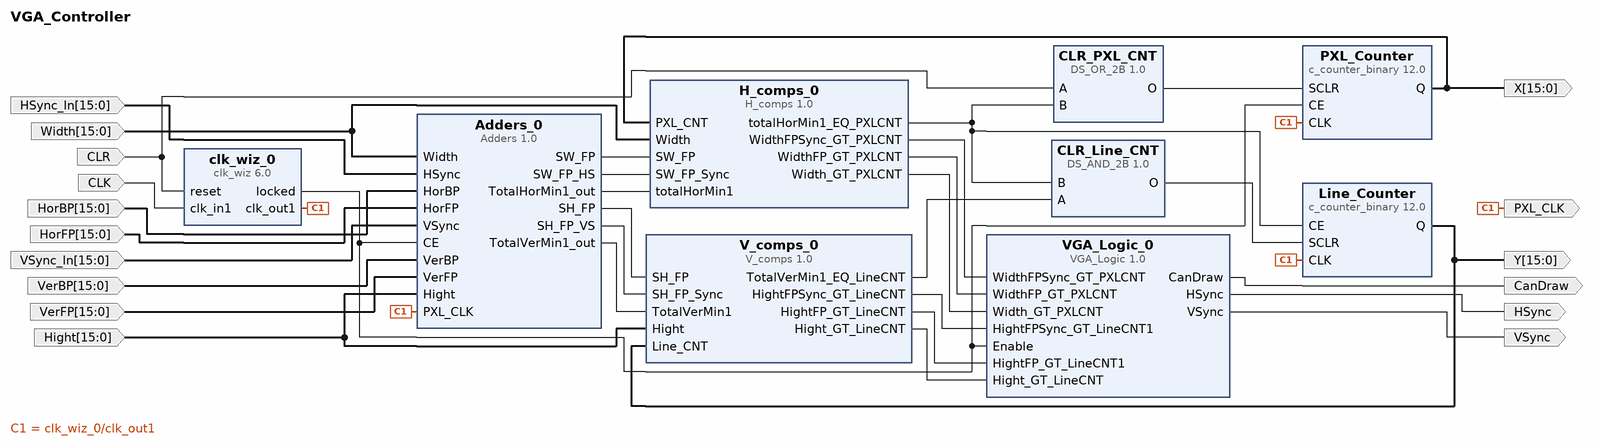
[diagram p0: block diagram of the top level]
# Vivado block design VGA_Controller, xc7z020clg400-1, Vivado 2019.2
create_bd_design VGA_Controller

create_bd_port -dir I -type rst CLR
set_property -dict {CONFIG.POLARITY ACTIVE_HIGH} [get_bd_ports CLR]
create_bd_port -dir I -type clk CLK
set_property -dict {CONFIG.FREQ_HZ 125000000} [get_bd_ports CLK]
create_bd_port -dir O PXL_CLK
create_bd_port -dir O -from 15 -to 0 X
create_bd_port -dir O -from 15 -to 0 -type data Y
create_bd_port -dir O CanDraw
create_bd_port -dir O HSync
create_bd_port -dir O VSync
create_bd_port -dir I -from 15 -to 0 -type data HSync_In
create_bd_port -dir I -from 15 -to 0 -type data Hight
create_bd_port -dir I -from 15 -to 0 -type data HorBP
create_bd_port -dir I -from 15 -to 0 -type data HorFP
create_bd_port -dir I -from 15 -to 0 -type data VSync_In
create_bd_port -dir I -from 15 -to 0 -type data VerBP
create_bd_port -dir I -from 15 -to 0 -type data VerFP
create_bd_port -dir I -from 15 -to 0 -type data Width

create_bd_cell -type ip -vlnv xilinx.com:user:Adders:1.0 Adders_0
create_bd_cell -type ip -vlnv xilinx.com:ip:clk_wiz:6.0 clk_wiz_0
set_property -dict [list \
  CONFIG.CLKIN1_JITTER_PS 80.0 \
  CONFIG.CLKOUT1_JITTER 192.068 \
  CONFIG.CLKOUT1_PHASE_ERROR 222.385 \
  CONFIG.CLKOUT1_REQUESTED_OUT_FREQ 74.2 \
  CONFIG.MMCM_CLKFBOUT_MULT_F 46.375 \
  CONFIG.MMCM_CLKIN1_PERIOD 8.000 \
  CONFIG.MMCM_CLKOUT0_DIVIDE_F 15.625 \
  CONFIG.MMCM_DIVCLK_DIVIDE 5 \
  CONFIG.PRIM_IN_FREQ 125.000 \
] [get_bd_cells clk_wiz_0]
create_bd_cell -type ip -vlnv xilinx.com:ip:c_counter_binary:12.0 PXL_Counter
set_property -dict {CONFIG.CE true CONFIG.SCLR true} [get_bd_cells PXL_Counter]
create_bd_cell -type ip -vlnv xilinx.com:user:H_comps:1.0 H_comps_0
create_bd_cell -type ip -vlnv KULeuven:Digital_systems:DS_OR_2B:1.0 CLR_PXL_CNT
create_bd_cell -type ip -vlnv xilinx.com:ip:c_counter_binary:12.0 Line_Counter
set_property -dict {CONFIG.CE true CONFIG.SCLR true} [get_bd_cells Line_Counter]
create_bd_cell -type ip -vlnv xilinx.com:user:V_comps:1.0 V_comps_0
create_bd_cell -type ip -vlnv xilinx.com:user:VGA_Logic:1.0 VGA_Logic_0
create_bd_cell -type ip -vlnv KULeuven:Digital_systems:DS_AND_2B:1.0 CLR_Line_CNT

# ---- connections ----

connect_bd_net [get_bd_pins clk_wiz_0/clk_out1] \
  [get_bd_pins Adders_0/PXL_CLK] [get_bd_ports PXL_CLK] [get_bd_pins PXL_Counter/CLK] [get_bd_pins Line_Counter/CLK]
connect_bd_net [get_bd_ports CLK] [get_bd_pins clk_wiz_0/clk_in1]
connect_bd_net [get_bd_pins Adders_0/SH_FP] [get_bd_pins V_comps_0/SH_FP]
connect_bd_net [get_bd_pins Adders_0/SH_FP_VS] [get_bd_pins V_comps_0/SH_FP_Sync]
connect_bd_net [get_bd_pins Adders_0/SW_FP] [get_bd_pins H_comps_0/SW_FP]
connect_bd_net [get_bd_pins Adders_0/SW_FP_HS] [get_bd_pins H_comps_0/SW_FP_Sync]
connect_bd_net [get_bd_pins Adders_0/TotalHorMin1_out] [get_bd_pins H_comps_0/totalHorMin1]
connect_bd_net [get_bd_pins Adders_0/TotalVerMin1_out] [get_bd_pins V_comps_0/TotalVerMin1]
connect_bd_net -net c_counter_binary_0_Q [get_bd_pins PXL_Counter/Q] [get_bd_ports X] [get_bd_pins H_comps_0/PXL_CNT]
connect_bd_net [get_bd_pins H_comps_0/WidthFPSync_GT_PXLCNT] [get_bd_pins VGA_Logic_0/WidthFPSync_GT_PXLCNT]
connect_bd_net [get_bd_pins H_comps_0/WidthFP_GT_PXLCNT] [get_bd_pins VGA_Logic_0/WidthFP_GT_PXLCNT]
connect_bd_net [get_bd_pins H_comps_0/Width_GT_PXLCNT] [get_bd_pins VGA_Logic_0/Width_GT_PXLCNT]
connect_bd_net [get_bd_pins clk_wiz_0/locked] [get_bd_pins PXL_Counter/CE] [get_bd_pins Adders_0/CE] [get_bd_pins VGA_Logic_0/Enable]
connect_bd_net [get_bd_ports CLR] [get_bd_pins clk_wiz_0/reset] [get_bd_pins CLR_PXL_CNT/A]
connect_bd_net -net DS_OR_2B_0_O [get_bd_pins CLR_PXL_CNT/O] [get_bd_pins PXL_Counter/SCLR]
connect_bd_net -net c_counter_binary_0_Q1 [get_bd_pins Line_Counter/Q] [get_bd_ports Y] [get_bd_pins V_comps_0/Line_CNT]
connect_bd_net [get_bd_pins V_comps_0/HightFPSync_GT_LineCNT] [get_bd_pins VGA_Logic_0/HightFPSync_GT_LineCNT1]
connect_bd_net [get_bd_pins V_comps_0/HightFP_GT_LineCNT] [get_bd_pins VGA_Logic_0/HightFP_GT_LineCNT1]
connect_bd_net [get_bd_pins V_comps_0/Hight_GT_LineCNT] [get_bd_pins VGA_Logic_0/Hight_GT_LineCNT]
connect_bd_net [get_bd_pins H_comps_0/totalHorMin1_EQ_PXLCNT] [get_bd_pins CLR_PXL_CNT/B] [get_bd_pins Line_Counter/CE] [get_bd_pins CLR_Line_CNT/B]
connect_bd_net [get_bd_pins VGA_Logic_0/CanDraw] [get_bd_ports CanDraw]
connect_bd_net [get_bd_pins VGA_Logic_0/HSync] [get_bd_ports HSync]
connect_bd_net [get_bd_pins VGA_Logic_0/VSync] [get_bd_ports VSync]
connect_bd_net [get_bd_ports HSync_In] [get_bd_pins Adders_0/HSync]
connect_bd_net [get_bd_ports Hight] [get_bd_pins Adders_0/Hight] [get_bd_pins V_comps_0/Hight]
connect_bd_net [get_bd_ports HorBP] [get_bd_pins Adders_0/HorBP]
connect_bd_net [get_bd_ports HorFP] [get_bd_pins Adders_0/HorFP]
connect_bd_net [get_bd_ports VSync_In] [get_bd_pins Adders_0/VSync]
connect_bd_net [get_bd_ports VerBP] [get_bd_pins Adders_0/VerBP]
connect_bd_net [get_bd_ports VerFP] [get_bd_pins Adders_0/VerFP]
connect_bd_net [get_bd_ports Width] [get_bd_pins Adders_0/Width] [get_bd_pins H_comps_0/Width]
connect_bd_net -net DS_AND_2B_0_O [get_bd_pins CLR_Line_CNT/O] [get_bd_pins Line_Counter/SCLR]
connect_bd_net [get_bd_pins V_comps_0/TotalVerMin1_EQ_LineCNT] [get_bd_pins CLR_Line_CNT/A]

validate_bd_design
save_bd_design
